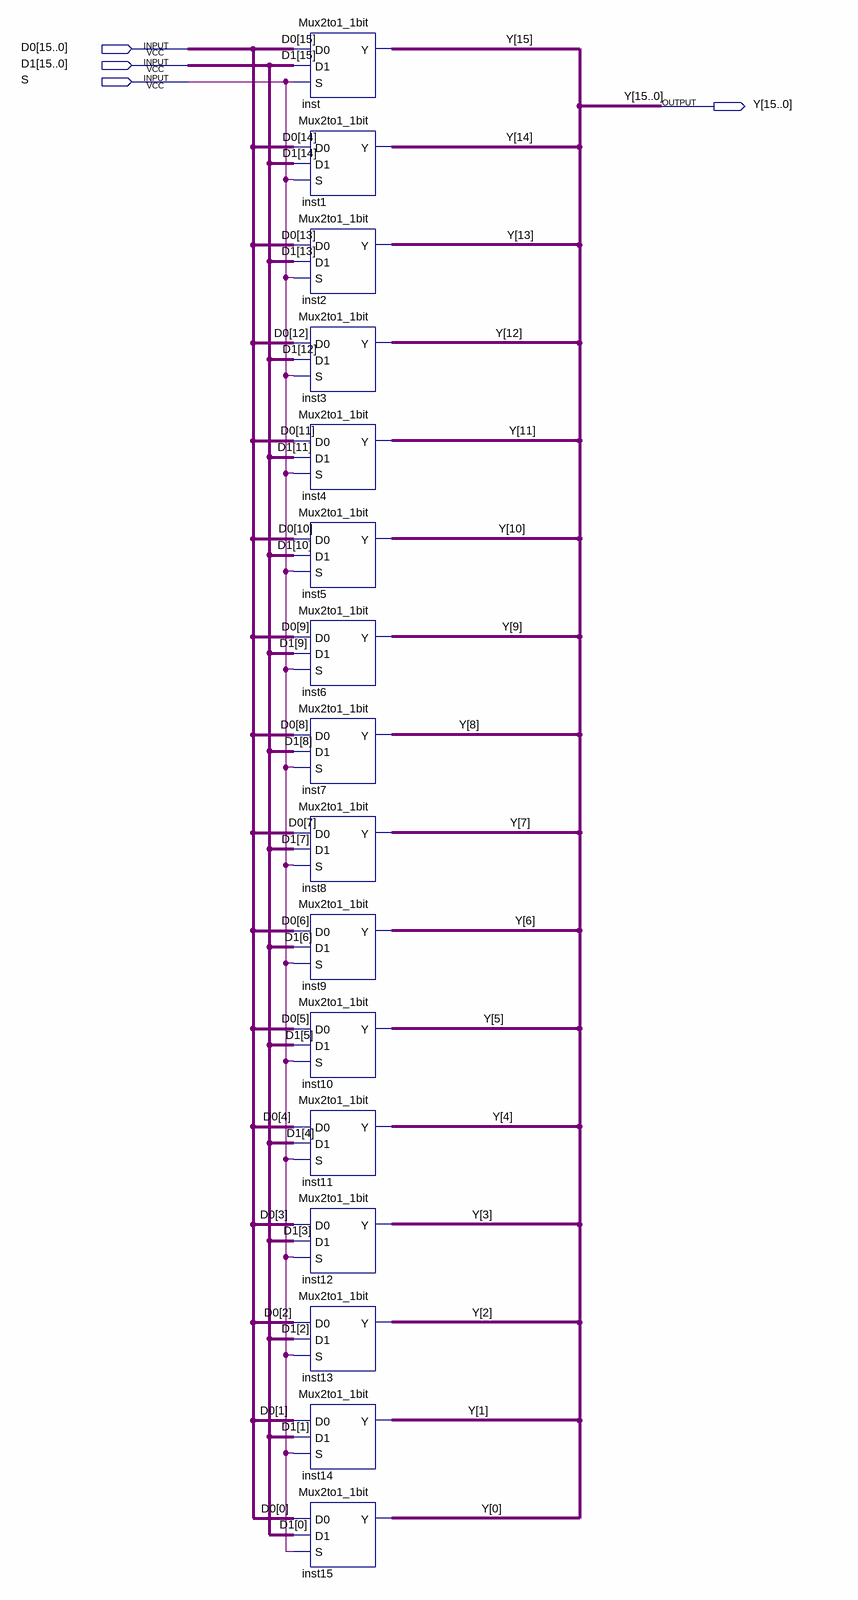
[diagram p0: schematic sheet]
// Quartus schematic Mux2to1_16bit.bdf as structural Verilog: 16 symbols, 4 pins
module Mux2to1_16bit (
  input  [15:0] D0,
  input  [15:0] D1,
  input  S,
  output [15:0] Y
);

  Mux2to1_1bit inst (.D0(D0[15]), .D1(D1[15]), .S(S), .Y(Y[15]));
  Mux2to1_1bit inst1 (.D0(D0[14]), .D1(D1[14]), .S(S), .Y(Y[14]));
  Mux2to1_1bit inst2 (.D0(D0[13]), .D1(D1[13]), .S(S), .Y(Y[13]));
  Mux2to1_1bit inst3 (.D0(D0[12]), .D1(D1[12]), .S(S), .Y(Y[12]));
  Mux2to1_1bit inst4 (.D0(D0[11]), .D1(D1[11]), .S(S), .Y(Y[11]));
  Mux2to1_1bit inst5 (.D0(D0[10]), .D1(D1[10]), .S(S), .Y(Y[10]));
  Mux2to1_1bit inst6 (.D0(D0[9]), .D1(D1[9]), .S(S), .Y(Y[9]));
  Mux2to1_1bit inst7 (.D0(D0[8]), .D1(D1[8]), .S(S), .Y(Y[8]));
  Mux2to1_1bit inst8 (.D0(D0[7]), .D1(D1[7]), .S(S), .Y(Y[7]));
  Mux2to1_1bit inst9 (.D0(D0[6]), .D1(D1[6]), .S(S), .Y(Y[6]));
  Mux2to1_1bit inst10 (.D0(D0[5]), .D1(D1[5]), .S(S), .Y(Y[5]));
  Mux2to1_1bit inst11 (.D0(D0[4]), .D1(D1[4]), .S(S), .Y(Y[4]));
  Mux2to1_1bit inst12 (.D0(D0[3]), .D1(D1[3]), .S(S), .Y(Y[3]));
  Mux2to1_1bit inst13 (.D0(D0[2]), .D1(D1[2]), .S(S), .Y(Y[2]));
  Mux2to1_1bit inst14 (.D0(D0[1]), .D1(D1[1]), .S(S), .Y(Y[1]));
  Mux2to1_1bit inst15 (.D0(D0[0]), .D1(D1[0]), .S(S), .Y(Y[0]));
endmodule
